# EAGLE design Programmer (EAGLE 6.3)
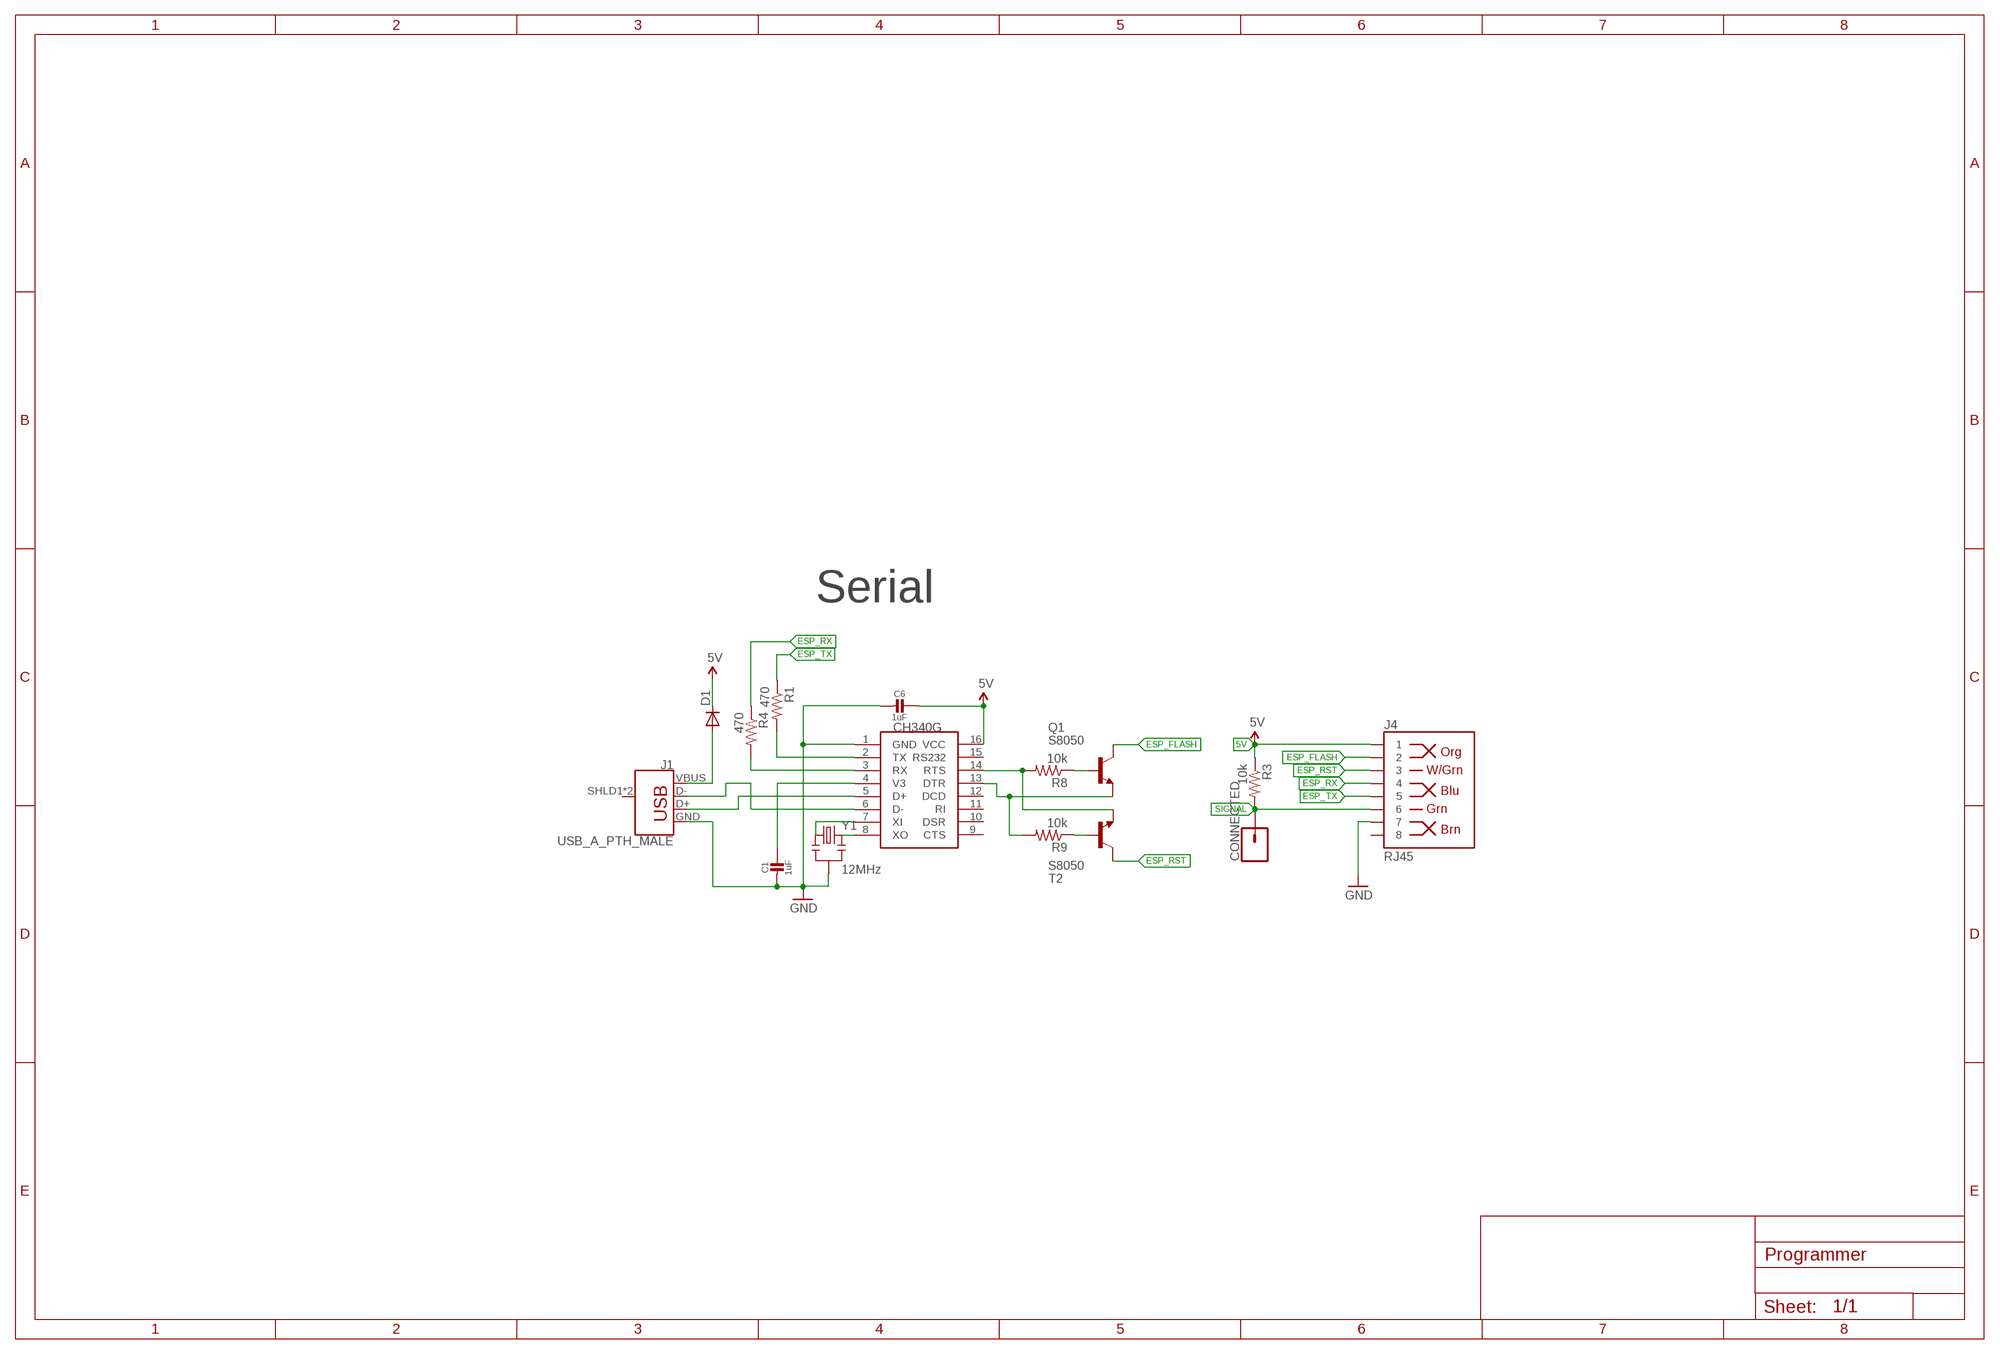
[diagram p0: schematic, sheet 1]

## Parts
C1  1uF  CAP_CERAMIC0805-NOOUTLINE  [0805-NO]
C6  1uF  CAP_CERAMIC0805-NOOUTLINE  [0805-NO]
CONNECTED  CONN_01  [1X01]
D1  DIODESOD  [SOD-323]
J1  USB_A_PTH_MALE  [USB-A-H]
J4  RJ45  RJ45-8  [RJ45-8]
Q1  S8050  BC817-16LT1-NPN-SOT23-BEC  [SOT23-BEC]
R1  470  RESISTOR0805  [0805]
R3  10k  RESISTOR0805  [0805]
R4  470  RESISTOR0805  [0805]
R8  10k  RESISTOR0805  [0805]
R9  10k  RESISTOR0805  [0805]
T2  S8050  BC817-16LT1-NPN-SOT23-BEC  [SOT23-BEC]
U$4  CH340G  [SOIC16]
Y1  12MHz  RESONATORSMD  [RESONATOR-SMD]

## Nets
5V: C6.1 D1.1(C) J4.1 R3.1 U$4.16(VCC)
ESP_FLASH: J4.2 Q1.C
ESP_RST: J4.3 T2.C
ESP_RX: J4.4 R4.1
ESP_TX: J4.5 R1.1
GND: C1.2 C6.2 J1.GND J4.7 U$4.1(GND) Y1.2
N$1: C1.1 U$4.4(V3)
N$2: U$4.8(XO) Y1.3
N$3: J1.D- U$4.6(D-)
N$4: J1.D+ U$4.5(D+)
N$5: R8.2 T2.E U$4.14(RTS)
N$6: U$4.7(XI) Y1.1
N$7: R4.2 U$4.3(RX)
N$13: R1.2 U$4.2(TX)
N$29: Q1.B R8.1
N$30: R9.1 T2.B
N$31: Q1.E R9.2 U$4.13(DTR)
SIGNAL: CONNECTED.1 J4.6 R3.2
VBUS1: D1.2(A) J1.VBUS
Unconnected: J1.SHLD1(SHIELD) J1.SHLD2(SHIELD) J4.8 U$4.9(CTS) U$4.10(DSR) U$4.11(RI) U$4.12(DCD) U$4.15(RS232)

## Notes on the sheet
- Serial

## Library data of the parts
C1 C6 = microbuilder:CAP_CERAMIC: Ceramic Capacitors For new designs, use the packages preceded by an '_' character since they are more reliable: The following footprints should be used on most boards: _0402 - Standard footprint for regular board layouts _0603 - Standard footprint for regular board layouts _0805 - Standard footprint for regular board layouts _1206 - Standard footprint for regular board layouts For extremely tight-pitch boards where space is at a premium, the following 'micro-pitch' footprints can be used (smaller pads, no silkscreen outline, etc.): _0402MP - Micro-pitch footprint for very dense/compact boards _0603MP - Micro-pitch footprint for very dense/compact boards _0805MP - Micro-pitch footprint for very dense/compact boards _1206MP - Micro-pitch footprint for very dense/compact boards
CONNECTED = SparkFun-Connectors:CONN_01: Single connection point. Often used as Generic Header-pin footprint for 0.1 inch spaced/style header connections On any of the 0.1 inch spaced packages, you can populate with these: Break Away Headers - Straight <https://www.sparkfun.com/products/116> (PRT-00116) Break Away Male Headers - Right Angle <https://www.sparkfun.com/products/553> (PRT-00553) Female Headers <https://www.sparkfun.com/products/115> (PRT-00115) Break Away Headers - Machine Pin <https://www.sparkfun.com/products/117> (PRT-00117) Break Away Female Headers - Swiss Machine Pin <https://www.sparkfun.com/products/743> (PRT-00743) This device is also useful as a general connection point to wire up your design to another part of your project. Our various solder wires solder well into these plated through hole pads. Hook-Up Wire - Assortment (Stranded, 22 AWG) <https://www.sparkfun.com/products/11375> (PRT-11375) Hook-Up Wire - Assortment (Solid Core, 22 AWG) <https://www.sparkfun.com/products/11367> (PRT-11367) View the entire wire category on our website here <https://www.sparkfun.com/categories/141> Special notes: SMTSO-256-ET is a "flush mount" nut for a 4-40 screw. We mostly use this on specialty testbeds; it is a nice way to connect hardware to your PCB at an adjustable hieght. Also note, the SNAP packages are for using a snappable style connector. We sell a baggie of snaps and they are also used on two LilyPad designs: Snap Assortment - 30 pack (male and female) <https://www.sparkfun.com/products/11347> (DEV-11347) LilyPad Arduino SimpleSnap <https://www.sparkfun.com/products/10941> (DEV-10941) LilyPad SimpleSnap Protoboard <https://www.sparkfun.com/products/10940> (DEV-10940)
D1 = SparkFun-DiscreteSemi:DIODE: Diode These are standard reverse protection diodes and small signal diodes. SMA package can handle up to about 1A. SOD-323 can handle about 200mA. What the SOD-323 package when ordering, there are some mfgs out there that are 5-pin packages.; PROD_ID: DIO-09646
J1 = SparkFun-Connectors:USB_A: USB-A Connector Male and female variants, as well as PTH and SMT variants SparkFun Products: SparkFun XBee Explorer Dongle <https://www.sparkfun.com/products/11697> PTH Male SparkFun MicroView-USB Programmer <https://www.sparkfun.com/products/12924> SMT Male SparkFun USB Type A Female Breakout <https://www.sparkfun.com/products/12700> SMT Female; PROD_ID: CONN-08367; SF_ID: PRT-00437
J4 = SparkFun-Connectors:RJ45-8: RJ45 Jack - 8 pin Simple RJ45, 8-pin connection. Commonly used for Cat5, Cat5e, and Cat6 Ethernet cables. Here is the connector we sell at SparkFun: RJ45 8-Pin Connector <https://www.sparkfun.com/products/643> (PRT-00643) Datasheet <https://cdn.sparkfun.com/datasheets/Prototyping/04908.pdf> It is used on this SparkFun product: SparkFun RJ45 Breakout <https://www.sparkfun.com/products/716> (BOB-00716) Note, you may also be interested in the "MAGJACK" version of this. It is basically a RJ45 connector, but also has some status LEDs built into the connector housing. You can check that out in this library at the device named "MAGJACK.dev" and see these products online: RJ45 Ethernet MagJack-Compatible <https://www.sparkfun.com/products/8534> (PRT-08534) SparkFun RJ45 MagJack Breakout <https://www.sparkfun.com/products/13021> (BOB-13021); PROD_ID: CONN-08506; SF_ID: PRT-00643
Q1 T2 = transistor:*-NPN-: NPN Transistror BF959 corrected 2008.03.06
R1 R3 R4 R8 R9 = LowPowerLab:RESISTOR: Resistor Basic schematic elements and footprints for 0603, 1206, and PTH resistors.
U$4 = ch340g:CH340G
Y1 = SparkFun:RESONATOR: Resonator Small SMD resonator. This is the itty bitty 10/20MHz resonators with built in caps. CSTCE10M0G55 and CSTCE20M0V53. Footprint has been reviewed closely but hasn't been tested yet.

## Board
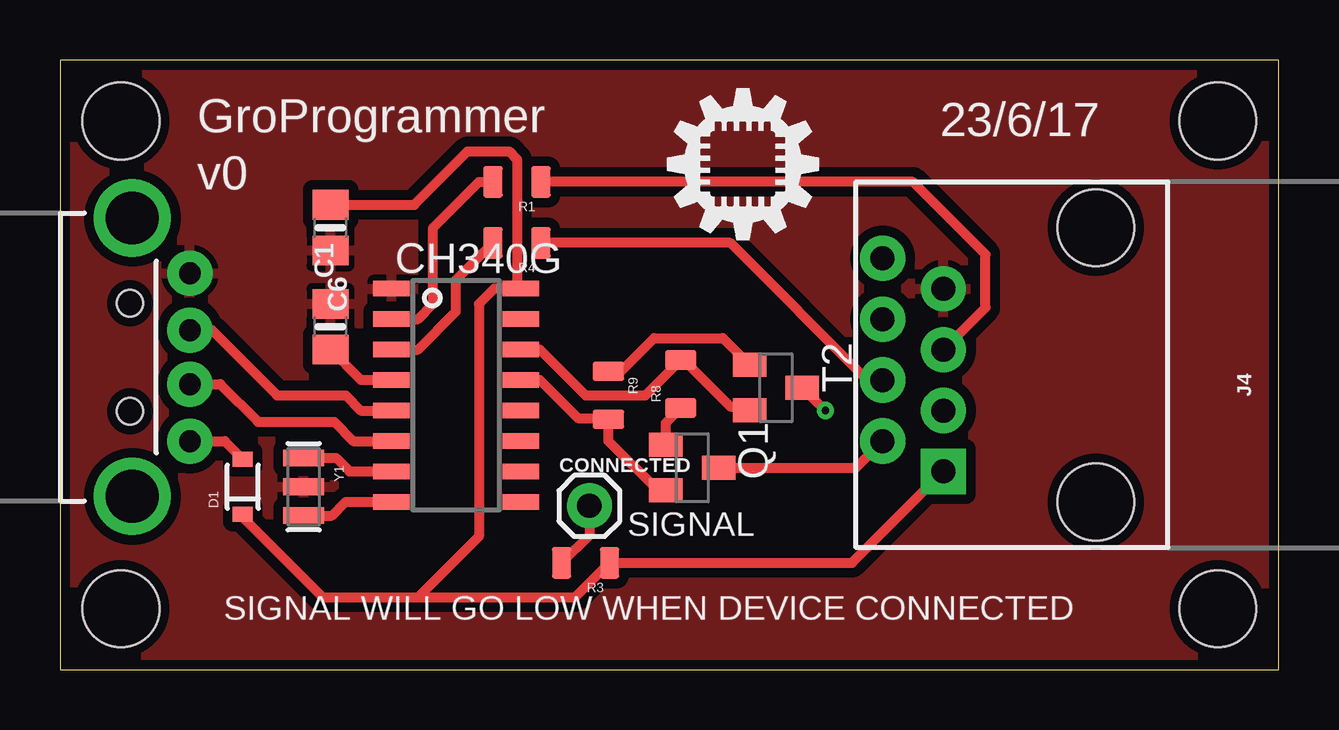
[diagram p1: board, top side]
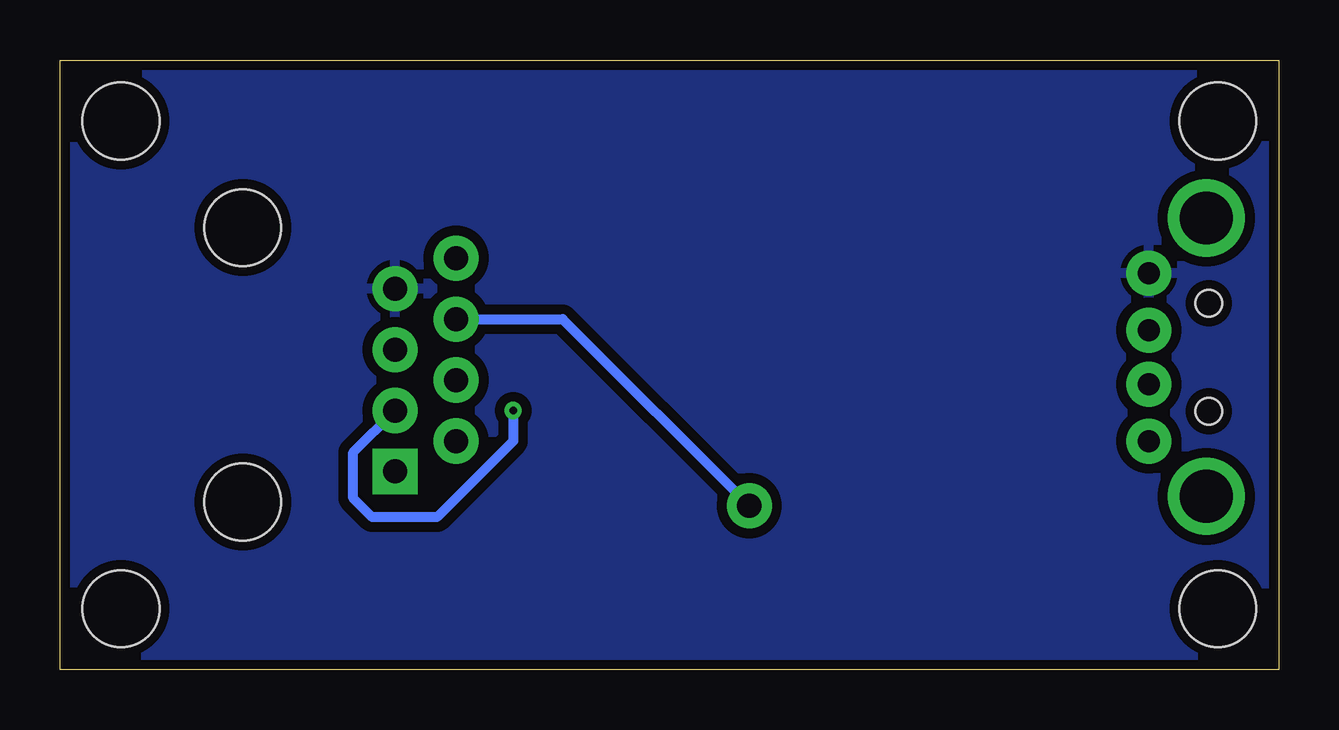
[diagram p2: board, bottom side, seen from below]

Size 50.8 x 25.4 mm. Coordinates in mm from the lower left corner, seen from the top.
Outline: 0,0 50.8,0 50.8,25.4 0,25.4 0,0
Copper layers (1*16): Top 0.035mm / dielectric 1.5mm / Bottom 0.035mm
Design rules "DFRobot_Eagle_Rule_v0.4": minimum track width 6mil, minimum drill 12mil, track to track 6mil, track to pad 6mil, pad to pad 6mil, via to via 6mil, smd to smd 0mil, copper to edge 10mil, drill to drill 10mil, minimum pad ring 12mil, minimum via ring 8mil, stop-mask expansion 2mil, vias tented up to drill 25mil, thermal gap 10mil
Holes 3.2 mm at 2.54,2.54 48.26,2.54 48.26,22.86 2.54,22.86

### Footprints (pad centres in the part's own frame; a part is rotated, then mirrored left to right if it is on the bottom)
0805-NO = smd 1.24 x 1.5: 1 -0.95,0; 2 0.95,0
1X01 = drill 1.016 pad 1.88: 1 0,0
SOD-323 = smd 0.63 x 0.83: 1 -1.15,0; 2 1.15,0
USB-A-H = drill 0.914 pad 1.88: D+ 2.4,1.127; D- 2.4,-1.127; GND 2.4,3.5; VBUS 2.4,-3.5 | drill 2.2: SHLD1 0,-5.8; SHLD2 0,5.8 | hole 1.1: -0.1,2.25; -0.1,-2.25
RJ45-8 = drill 1 pad 1.88 square: 1 -4.445,6.35 | drill 1 pad 1.88: 2 -3.175,8.89; 3 -1.905,6.35; 4 -0.635,8.89; 5 0.635,6.35; 6 1.905,8.89; 7 3.175,6.35; 8 4.445,8.89 | hole 3.2: -5.715,0; 5.715,0
SOT23-BEC = smd 1 x 1.4: B -0.95,-1.1; C 0,1.1; E 0.95,-1.1
0805 = smd 0.8 x 1.3: 1 -1,0; 2 1,0
SOIC16 = smd 0.635 x 1.524: 1 -4.445,-2.695; 2 -3.175,-2.695; 3 -1.905,-2.695; 4 -0.635,-2.695; 5 0.635,-2.695; 6 1.905,-2.695; 7 3.175,-2.695; 8 4.445,-2.695; 9 4.445,2.695; 10 3.175,2.695; 11 1.905,2.695; 12 0.635,2.695; 13 -0.635,2.695; 14 -1.905,2.695; 15 -3.175,2.695; 16 -4.445,2.695
RESONATOR-SMD = smd 0.7 x 1.7: 1 -1.2,0; 2 0,0; 3 1.2,0

### Placement (x,y rotation side)
C1  11.27,14.29 90 top
C6  11.27,18.41 270 top
CONNECTED  22.07,6.83 0 top
D1  7.62,7.62 90 top
J1  3.02,13.02 0 top
J4  43.18,12.7 90 top
Q1  26.35,8.41 270 top
R1  19.05,20.32 180 top
R3  21.91,4.45 180 top
R4  19.05,17.78 180 top
R8  25.88,11.91 90 top
R9  22.86,11.43 270 top
T2  29.84,11.75 270 top
U$1  [ID_LOGO_X0.25]  25.24,17.78 0 top
U$4  16.51,11.43 270 top
U$20  [ID_LOGO_X0.25]  -19.84,76.83 0 top  (outside the outline)
Y1  10.16,7.62 270 top

### Tracks (layer width: path | path; a pad name or v marks a point on that pad's centre or on a via)
5V
  Top 0.406: D1.1 7.62,6.35 10.95,3.02 14.92,3.02 | 14.92,3.02 21.48,3.02 R3.1 33.02,4.45 J4.1 | C6.1 14.76,19.36 16.99,21.59 18.73,21.59 19.05,21.27 19.05,16.03 U$4.16 18.1,15.88 17.46,15.24 17.46,5.56 14.92,3.02
ESP_FLASH
  Top 0.406: Q1.C 33.18,8.41 J4.2
ESP_RST  (via drill 0.3)
  Top 0.406: T2.C v31.91,10.79
  Bottom 0.406: v31.91,10.79 31.91,9.53 35.08,6.35 37.78,6.35 38.58,7.14 38.58,9.05 J4.3
ESP_RX
  Top 0.406: J4.4 33.66,12.06 27.94,17.78 R4.1
ESP_TX
  Top 0.406: J4.5 38.58,15.08 38.58,17.3 35.56,20.32 R1.1
GND
  pour Top (isolate 0.406): 0,0 50.8,0 50.8,25.4 0,25.4
  pour Bottom (isolate 0.406): 0,25.4 50.8,25.4 50.8,0 0,0
N$1
  Top 0.406: U$4.4 12.54,12.06 C1.1
N$2
  Top 0.406: Y1.3 11.34,6.42 11.91,6.99 U$4.8
N$3
  Top 0.406: J1.D- 6.68,11.89 8.26,10.32 11.43,10.32 12.22,9.53 U$4.6
N$4
  Top 0.406: J1.D+ 6.33,14.14 9.05,11.43 11.91,11.43 12.54,10.79 U$4.5
N$5
  Top 0.406: U$4.14 20,13.34 21.91,11.43 24.4,11.43 R8.2 25.99,12.91 27.94,10.95 28.59,10.95 T2.E
N$6
  Top 0.406: Y1.1 11.5,8.82 12.06,8.26 U$4.7
N$7
  Top 0.406: U$4.3 14.92,13.34 16.51,14.92 16.51,16.24 R4.2
N$13
  Top 0.406: U$4.2 14.92,14.61 15.56,15.24 15.56,18.41 17.46,20.32 R1.2
N$29
  Top 0.406: Q1.B 25.25,10.28 R8.1
N$30
  Top 0.406: R9.1 23.38,12.43 24.77,13.81 27.63,13.81 T2.B
N$31
  Top 0.406: Q1.E 24.92,7.46 22.86,9.53 R9.2 22.81,10.48 21.59,10.48 20,12.06 U$4.13
SIGNAL
  Top 0.406: CONNECTED.1 22.07,5.6 R3.2
  Bottom 0.406: J4.6 29.84,14.61 CONNECTED.1
VBUS1
  Top 0.406: J1.VBUS 6.87,9.52 D1.2

### Text on the board
tPlace: GroProgrammer | 23/6/17 | v0 | SIGNAL | SIGNAL WILL GO LOW WHEN DEVICE CONNECTED